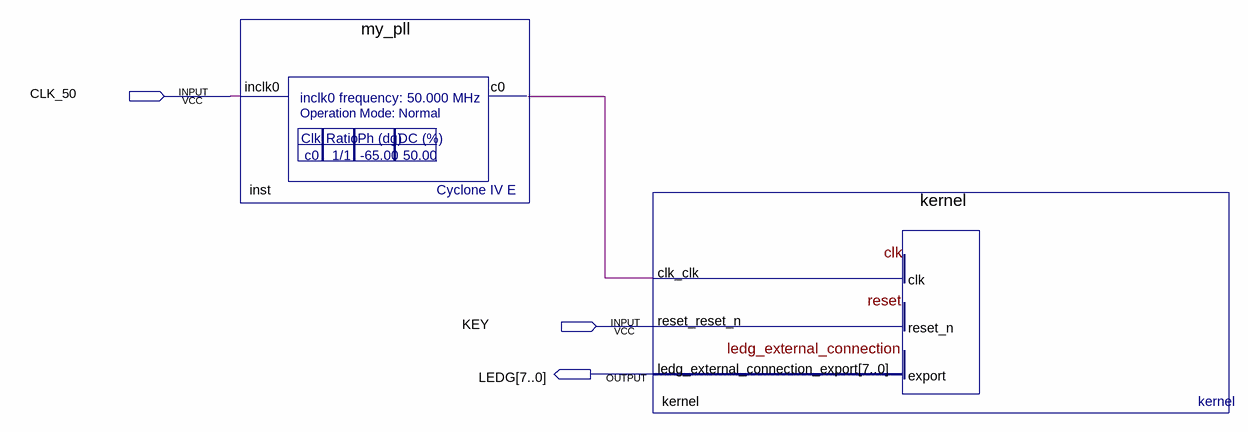
[diagram p0: schematic sheet]
// Quartus schematic E5_SOPC.bdf as structural Verilog: 2 symbols, 3 pins
module E5_SOPC (
  input  CLK_50,
  input  KEY,
  output [7:0] LEDG
);

  wire inst_c0;

  my_pll inst (.inclk0(CLK_50), .c0(inst_c0));
  kernel kernel (.clk_clk(inst_c0), .ledg_external_connection_export(LEDG));  // open: reset_reset_n
endmodule
